# Altium schematic sheet 86型ZigBee智能插座.SchDoc: 86型ZigBee智能插座板
size A4; Organization: 智能实训室产品部; Address1: 广东省深圳市; Address2: 宝安区石岩凯普达工业园; DocumentNumber: 190607; Revision: V2.1; SheetNumber: 1; SheetTotal: 1; Date: 2019-05-18; ApprovedBy: 杨青; CheckedBy: 杨青; DrawnBy: 李剑平; Engineer: 李剑平; ProjectName_GTA: 江工物联网; PCB Number: GS-86B-GXO03
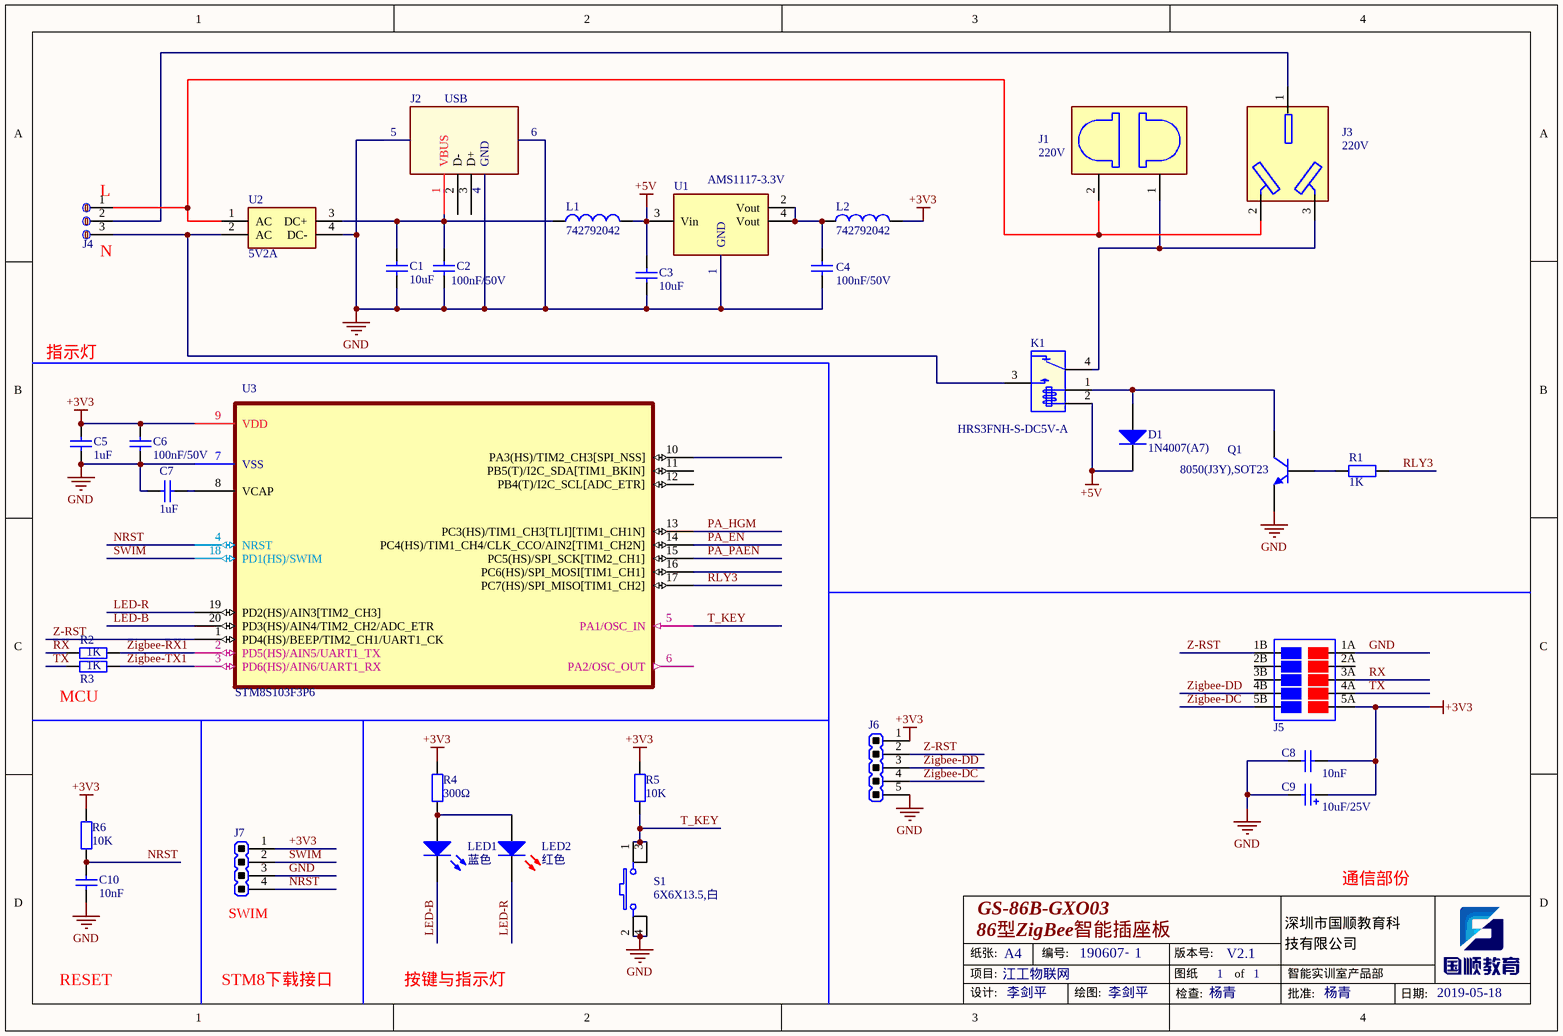
[diagram p0: 86型ZigBee智能插座.SchDoc]

## Parts
C1  10uF  [C0603]
C2  100nF/50V  [C0603]
C3  10uF  [C0603]
C4  100nF/50V  [C0603]
C5  1uF  [C0603]
C6  100nF/50V  [C0603]
C7  1uF  [C0603]
C8  10nF  [C0603]
C9  10uF/25V  [TC3528X21B]
C10  10nF  [C0603]
D1  1N4007(A7)  [SOD-123FL]
J1  220V  [JACK-2 Line]
J2  USB  [USB-F-Type A]
J3  220V  [JACK-3 Line]
J4  PILLAR-3P-11.5-(6.5*4.5*8+G4.2*1.5*2)  [PILLAR-3P-11.5-(6.5*4.5*8+G4.2*1.5*2)]  (value not drawn)
J5  EDGE 10P-2.54/1.0-F  [EDGE 10P-2.54/1.0-F]  (value not drawn)
J6  HDRM-1*5-2.54-AK  [HDRM-1*5-2.54-AK1]  (value not drawn)  (no BOM)
J7  HDRM-1*4-2.54-AK  [HDRM-1*4-2.54-AK1]  (value not drawn)  (no BOM)
K1  HRS3FNH-S-DC5V-A  [RELAY_HRS3FNH-S-DCxV-A]
L1  742792042  [L0805]
L2  742792042  [L0805]
LED1  蓝色  [LED0805-B1]
LED2  红色  [LED0805-R1]
Q1  8050(J3Y),SOT23  [SOT23]
R1  1K  [R0603]
R2  1K  [R0603]
R3  1K  [R0603]
R4  300Ω  [R0603]
R5  10K  [R0603]
R6  10K  [R0603]
S1  6X6X13.5,白  [SW2-6.0X6.0X13.5-W]
U1  AMS1117-3.3V  [SOT-223]
U2  5V2A  [Module_RPD10W]
U3  STM8S103F3P6  [TSSOP20-0.65/4.4]

## Nets
+3V3: C5.2 C6.1 C8.2 C9.1 J5.5A J6.1 J7.1 L2.2 R4.2 R5.1 R6.1 U3.9(VDD)
+5V: C3.1 D1.2(K) K1.2(COIL2) L1.2 U1.3(Vin)
GND: C1.2 C2.2 C3.2 C4.2 C5.1 C6.2 C7.2 C8.1 C9.2 C10.1 J2.4(GND) J2.5 J2.6 J5.1A J6.5 J7.3 Q1.2(E) S1.2 S1.4 U1.1(GND) U2.4(DC-) U3.7(VSS)
LED-B: LED1.2(K) U3.20(PD3(HS)/AIN4/TIM2_CH2/ADC_ETR)
LED-R: LED2.2(K) U3.19(PD2(HS)/AIN3[TIM2_CH3])
NRST: C10.2 J7.4 R6.2 U3.4(NRST)
PA_EN: U3.14(PC4(HS)/TIM1_CH4/CLK_CCO/AIN2[TIM1_CH2N])
PA_HGM: U3.13(PC3(HS)/TIM1_CH3[TLI][TIM1_CH1N])
PA_PAEN: U3.15(PC5(HS)/SPI_SCK[TIM2_CH1])
RLY3: R1.2 U3.17(PC7(HS)/SPI_MISO[TIM1_CH2])
RX: J5.3A R2.1
SWIM: J7.2 U3.18(PD1(HS)/SWIM)
T_KEY: R5.2 S1.1 S1.3 U3.5(PA1/OSC_IN)
TX: J5.4A R3.1
Z-RST: J5.1B J6.2 U3.1(PD4(HS)/BEEP/TIM2_CH1/UART1_CK)
Zigbee-DC: J5.5B J6.4
Zigbee-DD: J5.4B J6.3
Zigbee-RX1: R2.2 U3.2(PD5(HS)/AIN5/UART1_TX)
Zigbee-TX1: R3.2 U3.3(PD6(HS)/AIN6/UART1_RX)
NetC1_1: C1.1 C2.1 J2.1(VBUS) L1.1 U2.3(DC+)
NetC4_1: C4.1 L2.1 U1.2(Vout) U1.4(Vout)
NetC7_1: C7.1 U3.8(VCAP)
NetD1_1: D1.1(A) K1.1(COIL1) Q1.3(C)
NetJ1_1: J1.1 J3.3 K1.4(COM)
NetJ1_2: J1.2 J3.2 J4.1 U2.1(AC)
NetJ3_1: J3.1 J4.2
NetJ4_3: J4.3 K1.3(NO) U2.2(AC)
NetLED1_1: LED1.1(A) LED2.1(A) R4.1
NetQ1_1: Q1.1(B) R1.1

Not connected (* = marked no-connect by the designer): J2 2(D-) 3(D+); J5 2A 2B 3B; U3 6(PA2/OSC_OUT) 10(PA3(HS)/TIM2_CH3[SPI_NSS]) 11(PB5(T)/I2C_SDA[TIM1_BKIN]) 12(PB4(T)/I2C_SCL[ADC_ETR]) 16(PC6(HS)/SPI_MOSI[TIM1_CH1])

## Notes on the sheet
- (near J4) L
- (near J4) N
- 指示灯
- MCU
- (near J7) SWIM
- 通信部份
- RESET
- STM8下载接口
- 按键与指示灯
- 纸张:
- 项目:
- A4
- 编号:
- -
- 版本号:
- 图纸
- of
- 深圳市国顺教育科
- 技有限公司
- 设计:
- 绘图:
- 检查:
- 批准:
- 日期:

## Library data of the parts
C1 C3 = 10uF_16V_0603: Capacitor; 编码: 无; 规格/型号: 10uF,16V,0603; 物料名称: 贴片电容
C2 C4 C6 = 100nF_50V_0603: Capacitor; 编码: 无; 规格/型号: 100nF,50V,0603; 物料名称: 贴片电容
C5 C7 = 1uF_25V_X7R_0603: Capacitor; 编码: 无; 规格/型号: 1uF,25V,X7R,0603; 物料名称: 贴片电容
C8 C10 = 10nF_16V_0603: Capacitor; 编码: 无; 规格/型号: 10nF,16V,0603; 物料名称: 贴片电容
C9 = CAPC-10uF/25V_3528B: 钽电容,10uF/25V-3528B; 编码: 1010202012; 物料名称: 贴片钽电容; 规格/型号: 钽电容,10uF,25V,3528,B型
D1 = 1N4007(A7)_SOD-123FL: 1N4007(A7),1A/1000V,SOD-123FL; 规格/型号: 1N4007,标字A7,1A,1000V,SOD-123FL; 物料名称: 贴片二极管; 单价: 0.02; 参数: 电流1A; 供应商: https://detail.tmall.com/item.htm?spm=a230r.1.14.56.29245539I1zJLh&id=553688496024&ns=1&abbucket=2
J1 = JACK-2 Line: PCB板电源插口; 物料名称: 电源接口
J2 = USB-AF-17.5: USB-TYPE A 母座; 规格/型号: USB母座,AF,180立式,平口,直插直针,高17.5; 物料名称: USB接口; 单价: 0.13; 供应商: https://item.taobao.com/item.htm?spm=a1z0d.7625083.1998302264.6.5c5f4e69BrYJYq&id=571323512490
J3 = JACK-3 Line: PCB板电源插口; 物料名称: 电源接口
J4 = PILLAR-3P-11.5-(6.5*4.5*8+G4.2*1.5*2): 铜柱接口; 规格/型号: 铜柱接线柱; 物料名称: 铜柱接口
J5 = EDGE 10P-2.54/1.0-F: 金手指PCB焊接位; 编码: 不需焊接; 规格/型号: 金手指; 物料名称: 金手指
J6 = HDRM-1*5-2.54-AK: 排针,直; 规格/型号: 排针,间距2.54,1*5P,180°直插; 物料名称: 排针
J7 = HDRM-1*4-2.54-AK: 排针,直; 规格/型号: 排针,间距2.54,1*4P,180°直插; 物料名称: 排针
K1 = RLY_HRS3FNH-S-DC5V-A: 汇港,HRS3FNH-S-DC5V-A,5V,4脚,容量10A,线圈功率0.45W; 物料名称: 继电器; 参数: 线圈功率0.45W,10A; 单价: 2; 供应商: https://item.taobao.com/item.htm?spm=a1z0d.6639537.1997196601.284.3c7874847XfGDa&id=569637074968; 规格/型号: 汇港,HRS3FNH-S-DC5V-A,5V,4脚,容量10A,线圈功率0.45W; 品牌: 汇港
L1 = BEAD-742792042_0805: 磁珠,WE-CBF,600@100M, / 500Ohm,200mA,0805,742792042; 品牌: WE; 物料名称: 贴片磁珠; 规格/型号: WE-CBF,磁珠,600@100M，500Ohm,200mA,0805,742792042; 单价: 0.04
L2 = BEAD-742792042_0805: WE-CBF,600@100M,500Ohm,200mA,0805,742792042; 品牌: WE; 物料名称: 贴片磁珠; 规格/型号: WE-CBF,磁珠,600@100M，500Ohm,200mA,0805,742792042; 单价: 0.04
LED1 = LED-蓝_0805: 0805 LED; 编码: 1010302003; 规格/型号: 0805,蓝色; 物料名称: 贴片发光二极管
LED2 = LED-红_0805: 0805 LED; 编码: 1010302001; 规格/型号: 0805,红色; 物料名称: 贴片发光二极管
Q1 = NPN_8050(J3Y)_SOT23: NPN,8050,SOT23; 编码: 1010401001; 规格/型号: NPN,8050,标字J3Y,SOT23; 物料名称: 三极管; 单价: 0.05
R1 = 10K_5%_0603: 1K,±5%,0603; 物料名称: 贴片电阻; 单价: 0.02; 规格/型号: 1K,±5%,0603
R2 R3 = 1K_5%_0603: 1K,±5%,0603; 编码: 1010101190; 物料名称: 贴片电阻; 单价: 0.02; 规格/型号: 1K,±5%,0603; 参数: ±5%
R4 = 300Ω_5%_0603: 300Ω,±5%,0603; 物料名称: 贴片电阻; 单价: 0.02; 规格/型号: 300Ω,±5%,0603
R5 R6 = 10K_5%_0603: 10K,±5%,0603; 物料名称: 贴片电阻; 单价: 0.02; 规格/型号: 10K,±5%,0603
S1 = SW-PB_6X6X13.5-4P-W: 6X6X13.5,白,插针; 编码: 无; 规格/型号: 轻触开关,6*6*13.5mm,4PIN,白色,插针; 物料名称: 插针式轻触开关; 供应商: https://item.taobao.com/item.htm?spm=a1z10.5-c.w4002-4906752333.24.4c8f076fOxczlX&id=36743938063
U1 = AMS1117-3.3V_SOT223: 三端稳压器; 编码: 1010402018; 规格/型号: AMS1117-3.3,SOT-223; 物料名称: 贴片芯片; 单价: 0.18
U2 = Module_RPD10W05E202S: AC/DC模块; 品牌: 瑞普达; 物料名称: 电路模块; 规格/型号: AC-DC降压模块,瑞普达,RPDZN,RPD10W05E202S,5V2A; 单价: 10; 供应商: https://item.taobao.com/item.htm?spm=2013.1.0.0.3db92e5exHUaLw&id=549851015885
U3 = STM8S103F3P6_TSSOP20: STM8 ARM-based 32-bit MCU with 8 Kbytes Flash, 20-pin TSSOP, Industrial Temperature; 物料名称: 贴片芯片; 规格/型号: STM8S103F3P6,TSSOP20